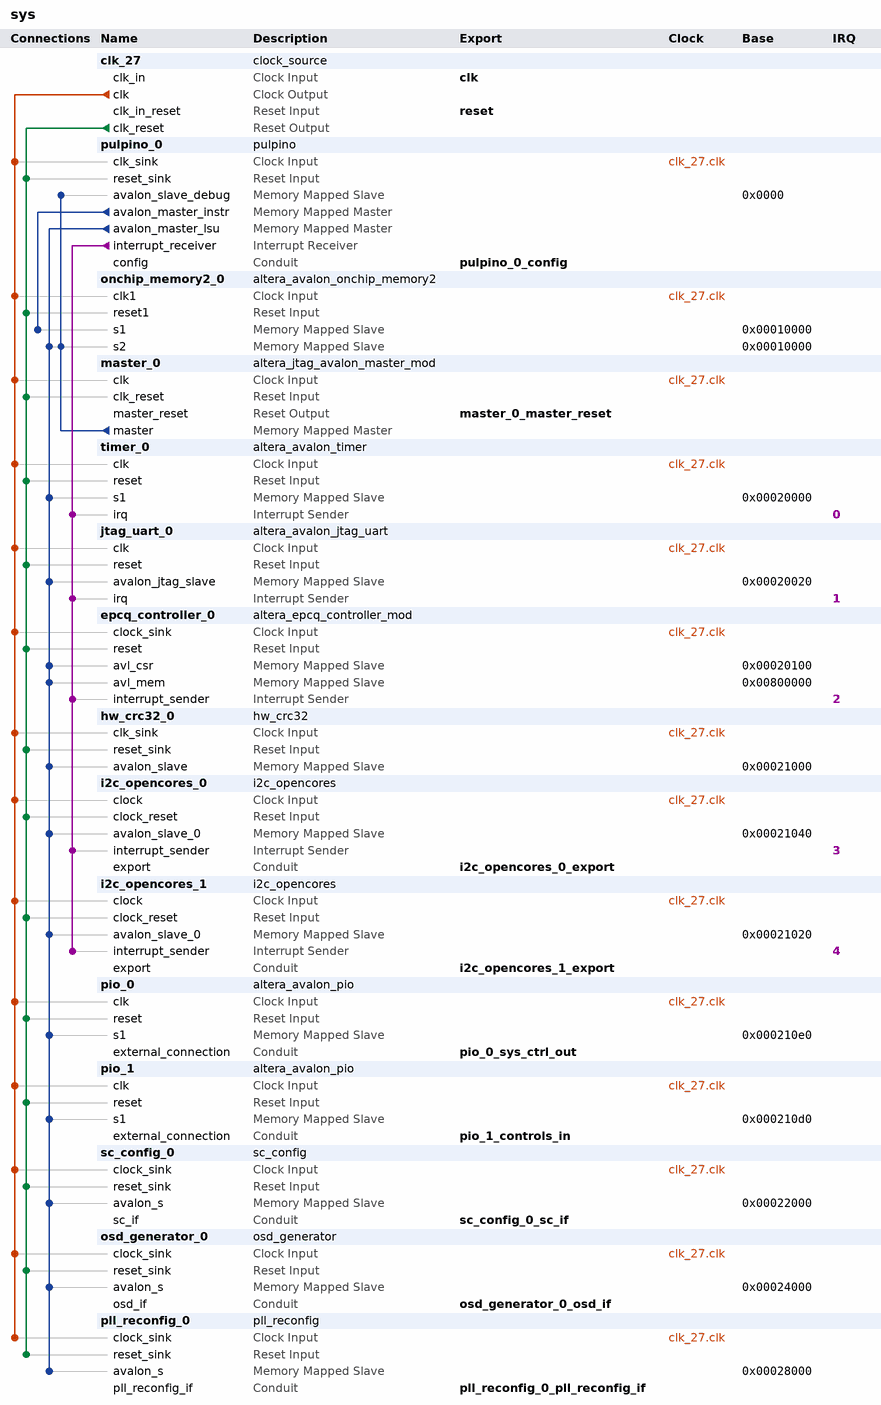
[diagram p0: system contents]
# Platform Designer (Qsys) system sys, Cyclone IV E EP4CE15E22C8
# Parameters at their usual value, and those the tool derives, are not listed.
package require -exact qsys 20.1
create_system sys
set_project_property DEVICE_FAMILY {Cyclone IV E}
set_project_property DEVICE EP4CE15E22C8

add_instance clk_27 clock_source 20.1
set_instance_parameter_value clk_27 clockFrequency 27000000

add_instance pulpino_0 pulpino 1.0
set_instance_parameter_value pulpino_0 AXI_ADDR_WIDTH 32
set_instance_parameter_value pulpino_0 AXI_DATA_WIDTH 32
set_instance_parameter_value pulpino_0 AXI_ID_MASTER_WIDTH 10
set_instance_parameter_value pulpino_0 AXI_ID_SLAVE_WIDTH 10
set_instance_parameter_value pulpino_0 AXI_USER_WIDTH 0
set_instance_parameter_value pulpino_0 RISCY_RV32F false
set_instance_parameter_value pulpino_0 USE_ZERO_RISCY true
set_instance_parameter_value pulpino_0 ZERO_RV32E true
set_instance_parameter_value pulpino_0 ZERO_RV32M true

add_instance onchip_memory2_0 altera_avalon_onchip_memory2 20.1
set_instance_parameter_value onchip_memory2_0 dataWidth 32
set_instance_parameter_value onchip_memory2_0 dualPort true
set_instance_parameter_value onchip_memory2_0 initMemContent true
set_instance_parameter_value onchip_memory2_0 initializationFileName onchip_mem.hex
set_instance_parameter_value onchip_memory2_0 memorySize 40960
set_instance_parameter_value onchip_memory2_0 singleClockOperation true

add_instance master_0 altera_jtag_avalon_master_mod 19.1
set_instance_parameter_value master_0 COMPONENT_CLOCK 0
set_instance_parameter_value master_0 FAST_VER 0
set_instance_parameter_value master_0 FIFO_DEPTHS 2
set_instance_parameter_value master_0 PLI_PORT 50000
set_instance_parameter_value master_0 USE_MEMORY_BLOCKS 0
set_instance_parameter_value master_0 USE_PLI 0

add_instance timer_0 altera_avalon_timer 20.1
set_instance_parameter_value timer_0 period 1
set_instance_parameter_value timer_0 periodUnits USEC

add_instance jtag_uart_0 altera_avalon_jtag_uart 20.1
set_instance_parameter_value jtag_uart_0 readBufferDepth 16
set_instance_parameter_value jtag_uart_0 simInteractiveOptions NO_INTERACTIVE_WINDOWS
set_instance_parameter_value jtag_uart_0 useRegistersForReadBuffer true
set_instance_parameter_value jtag_uart_0 useRegistersForWriteBuffer true
set_instance_parameter_value jtag_uart_0 writeBufferDepth 16

add_instance epcq_controller_0 altera_epcq_controller_mod 19.1
set_instance_parameter_value epcq_controller_0 CHIP_SELS 1
set_instance_parameter_value epcq_controller_0 DDASI 0
set_instance_parameter_value epcq_controller_0 FLASH_TYPE EPCS16
set_instance_parameter_value epcq_controller_0 IO_MODE STANDARD
set_instance_parameter_value epcq_controller_0 clkFreq 27000000

add_instance hw_crc32_0 hw_crc32 1.0

add_instance i2c_opencores_0 i2c_opencores 17.1
set_instance_parameter_value i2c_opencores_0 dedicated_spi 0

add_instance i2c_opencores_1 i2c_opencores 17.1
set_instance_parameter_value i2c_opencores_1 dedicated_spi 1

add_instance pio_0 altera_avalon_pio 20.1
set_instance_parameter_value pio_0 direction Output
set_instance_parameter_value pio_0 width 16

add_instance pio_1 altera_avalon_pio 20.1
set_instance_parameter_value pio_1 direction Input
set_instance_parameter_value pio_1 width 32

add_instance sc_config_0 sc_config 1.0

add_instance osd_generator_0 osd_generator 1.0

add_instance pll_reconfig_0 pll_reconfig 1.0

# connections
add_connection clk_27.clk epcq_controller_0.clock_sink clock
add_connection clk_27.clk hw_crc32_0.clk_sink clock
add_connection clk_27.clk i2c_opencores_0.clock clock
add_connection clk_27.clk i2c_opencores_1.clock clock
add_connection clk_27.clk jtag_uart_0.clk clock
add_connection clk_27.clk master_0.clk clock
add_connection clk_27.clk onchip_memory2_0.clk1 clock
add_connection clk_27.clk osd_generator_0.clock_sink clock
add_connection clk_27.clk pio_0.clk clock
add_connection clk_27.clk pio_1.clk clock
add_connection clk_27.clk pll_reconfig_0.clock_sink clock
add_connection clk_27.clk pulpino_0.clk_sink clock
add_connection clk_27.clk sc_config_0.clock_sink clock
add_connection clk_27.clk timer_0.clk clock
add_connection clk_27.clk_reset epcq_controller_0.reset reset
add_connection clk_27.clk_reset hw_crc32_0.reset_sink reset
add_connection clk_27.clk_reset i2c_opencores_0.clock_reset reset
add_connection clk_27.clk_reset i2c_opencores_1.clock_reset reset
add_connection clk_27.clk_reset jtag_uart_0.reset reset
add_connection clk_27.clk_reset master_0.clk_reset reset
add_connection clk_27.clk_reset onchip_memory2_0.reset1 reset
add_connection clk_27.clk_reset osd_generator_0.reset_sink reset
add_connection clk_27.clk_reset pio_0.reset reset
add_connection clk_27.clk_reset pio_1.reset reset
add_connection clk_27.clk_reset pll_reconfig_0.reset_sink reset
add_connection clk_27.clk_reset pulpino_0.reset_sink reset
add_connection clk_27.clk_reset sc_config_0.reset_sink reset
add_connection clk_27.clk_reset timer_0.reset reset
add_connection master_0.master onchip_memory2_0.s2 avalon
set_connection_parameter_value master_0.master/onchip_memory2_0.s2 baseAddress 0x00010000
add_connection master_0.master pulpino_0.avalon_slave_debug avalon
set_connection_parameter_value master_0.master/pulpino_0.avalon_slave_debug baseAddress 0x0000
add_connection pulpino_0.avalon_master_instr onchip_memory2_0.s1 avalon
set_connection_parameter_value pulpino_0.avalon_master_instr/onchip_memory2_0.s1 baseAddress 0x00010000
add_connection pulpino_0.avalon_master_lsu epcq_controller_0.avl_csr avalon
set_connection_parameter_value pulpino_0.avalon_master_lsu/epcq_controller_0.avl_csr baseAddress 0x00020100
add_connection pulpino_0.avalon_master_lsu epcq_controller_0.avl_mem avalon
set_connection_parameter_value pulpino_0.avalon_master_lsu/epcq_controller_0.avl_mem baseAddress 0x00800000
add_connection pulpino_0.avalon_master_lsu hw_crc32_0.avalon_slave avalon
set_connection_parameter_value pulpino_0.avalon_master_lsu/hw_crc32_0.avalon_slave baseAddress 0x00021000
add_connection pulpino_0.avalon_master_lsu i2c_opencores_0.avalon_slave_0 avalon
set_connection_parameter_value pulpino_0.avalon_master_lsu/i2c_opencores_0.avalon_slave_0 baseAddress 0x00021040
add_connection pulpino_0.avalon_master_lsu i2c_opencores_1.avalon_slave_0 avalon
set_connection_parameter_value pulpino_0.avalon_master_lsu/i2c_opencores_1.avalon_slave_0 baseAddress 0x00021020
add_connection pulpino_0.avalon_master_lsu jtag_uart_0.avalon_jtag_slave avalon
set_connection_parameter_value pulpino_0.avalon_master_lsu/jtag_uart_0.avalon_jtag_slave baseAddress 0x00020020
add_connection pulpino_0.avalon_master_lsu onchip_memory2_0.s2 avalon
set_connection_parameter_value pulpino_0.avalon_master_lsu/onchip_memory2_0.s2 baseAddress 0x00010000
add_connection pulpino_0.avalon_master_lsu osd_generator_0.avalon_s avalon
set_connection_parameter_value pulpino_0.avalon_master_lsu/osd_generator_0.avalon_s baseAddress 0x00024000
add_connection pulpino_0.avalon_master_lsu pio_0.s1 avalon
set_connection_parameter_value pulpino_0.avalon_master_lsu/pio_0.s1 baseAddress 0x000210e0
add_connection pulpino_0.avalon_master_lsu pio_1.s1 avalon
set_connection_parameter_value pulpino_0.avalon_master_lsu/pio_1.s1 baseAddress 0x000210d0
add_connection pulpino_0.avalon_master_lsu pll_reconfig_0.avalon_s avalon
set_connection_parameter_value pulpino_0.avalon_master_lsu/pll_reconfig_0.avalon_s baseAddress 0x00028000
add_connection pulpino_0.avalon_master_lsu sc_config_0.avalon_s avalon
set_connection_parameter_value pulpino_0.avalon_master_lsu/sc_config_0.avalon_s baseAddress 0x00022000
add_connection pulpino_0.avalon_master_lsu timer_0.s1 avalon
set_connection_parameter_value pulpino_0.avalon_master_lsu/timer_0.s1 baseAddress 0x00020000
add_connection pulpino_0.interrupt_receiver epcq_controller_0.interrupt_sender interrupt
set_connection_parameter_value pulpino_0.interrupt_receiver/epcq_controller_0.interrupt_sender irqNumber 2
add_connection pulpino_0.interrupt_receiver i2c_opencores_0.interrupt_sender interrupt
set_connection_parameter_value pulpino_0.interrupt_receiver/i2c_opencores_0.interrupt_sender irqNumber 3
add_connection pulpino_0.interrupt_receiver i2c_opencores_1.interrupt_sender interrupt
set_connection_parameter_value pulpino_0.interrupt_receiver/i2c_opencores_1.interrupt_sender irqNumber 4
add_connection pulpino_0.interrupt_receiver jtag_uart_0.irq interrupt
set_connection_parameter_value pulpino_0.interrupt_receiver/jtag_uart_0.irq irqNumber 1
add_connection pulpino_0.interrupt_receiver timer_0.irq interrupt
set_connection_parameter_value pulpino_0.interrupt_receiver/timer_0.irq irqNumber 0

# exported interfaces
add_interface clk clock sink
set_interface_property clk EXPORT_OF clk_27.clk_in
add_interface i2c_opencores_0_export conduit end
set_interface_property i2c_opencores_0_export EXPORT_OF i2c_opencores_0.export
add_interface i2c_opencores_1_export conduit end
set_interface_property i2c_opencores_1_export EXPORT_OF i2c_opencores_1.export
add_interface master_0_master_reset reset source
set_interface_property master_0_master_reset EXPORT_OF master_0.master_reset
add_interface osd_generator_0_osd_if conduit end
set_interface_property osd_generator_0_osd_if EXPORT_OF osd_generator_0.osd_if
add_interface pio_0_sys_ctrl_out conduit end
set_interface_property pio_0_sys_ctrl_out EXPORT_OF pio_0.external_connection
add_interface pio_1_controls_in conduit end
set_interface_property pio_1_controls_in EXPORT_OF pio_1.external_connection
add_interface pll_reconfig_0_pll_reconfig_if conduit end
set_interface_property pll_reconfig_0_pll_reconfig_if EXPORT_OF pll_reconfig_0.pll_reconfig_if
add_interface pulpino_0_config conduit end
set_interface_property pulpino_0_config EXPORT_OF pulpino_0.config
add_interface reset reset sink
set_interface_property reset EXPORT_OF clk_27.clk_in_reset
add_interface sc_config_0_sc_if conduit end
set_interface_property sc_config_0_sc_if EXPORT_OF sc_config_0.sc_if

set_interconnect_requirement {$system} qsys_mm.clockCrossingAdapter HANDSHAKE
set_interconnect_requirement {$system} qsys_mm.insertDefaultSlave false
set_interconnect_requirement {$system} qsys_mm.maxAdditionalLatency 1

save_system sys.qsys
